# EAGLE design bbSMDuino_v1 (EAGLE 6.3)
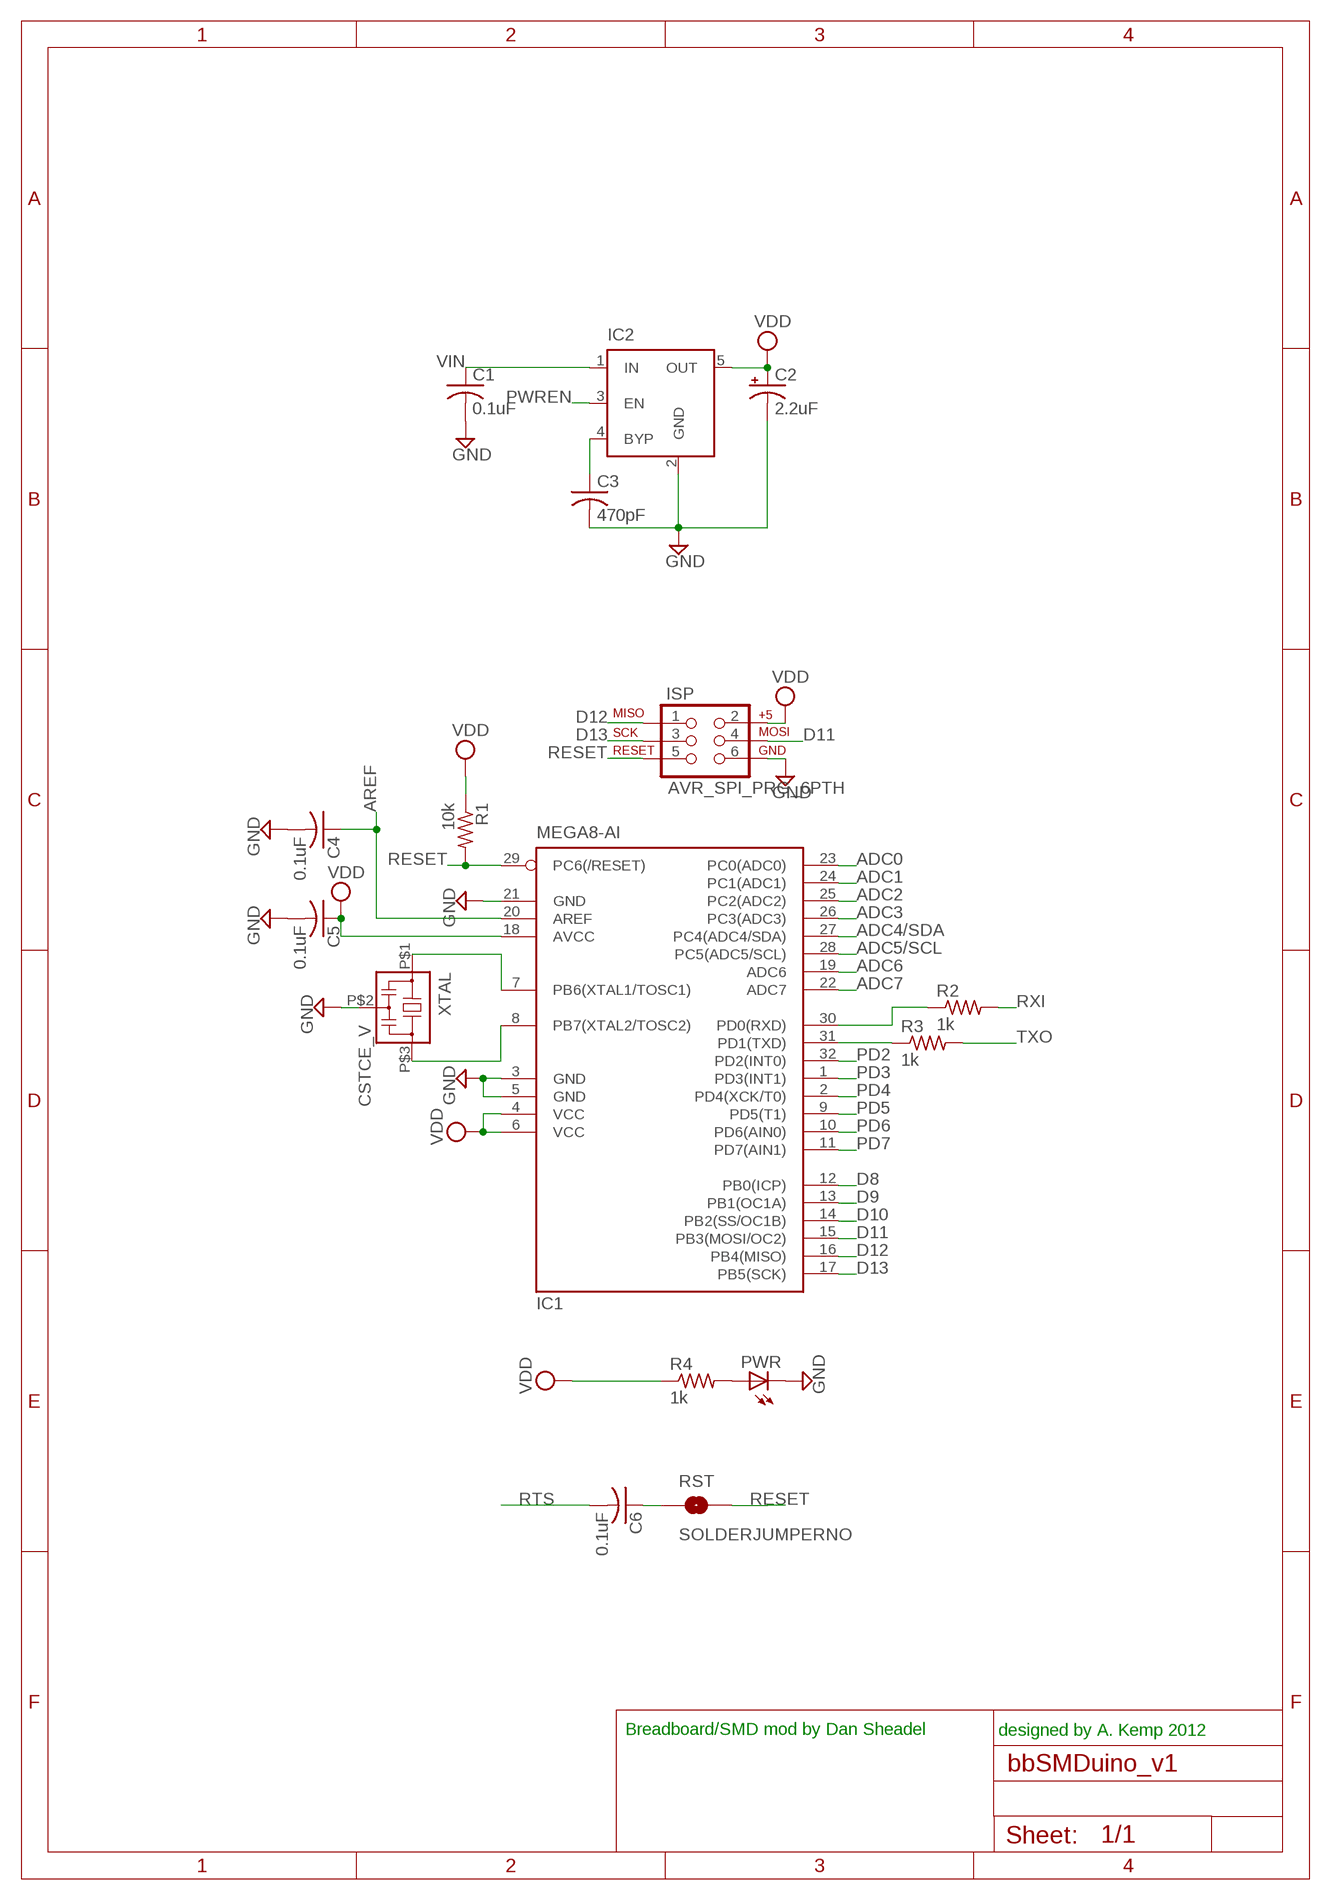
[diagram p0: schematic, sheet 1]

## Parts
C1  0.1uF  C-USC0603  [C0603]
C2  2.2uF  CPOL-USCT3216  [CT3216]
C3  470pF  C-USC0603  [C0603]
C4  0.1uF  C-USC0603  [C0603]
C5  0.1uF  C-USC0603  [C0603]
C6  0.1uF  C-USC0603  [C0603]
IC1  MEGA8-AI  [TQFP32-08]
IC2  MIC5219XX  [SOT23-5]
ISP  AVR_SPI_PRG_6PTH  [2X3]
PWR  LEDCHIP-LED0603  [CHIP-LED0603]
R1  10k  R-US_R0603  [R0603]
R2  1k  R-US_R0603  [R0603]
R3  1k  R-US_R0603  [R0603]
R4  1k  R-US_R0603  [R0603]
RST  SOLDERJUMPERNO  [SJ_2S-NO]
XTAL  CSTCE_V  [CSTCE_V]

## Nets
ADC0: IC1.23(PC0(ADC0))
ADC1: IC1.24(PC1(ADC1))
ADC2: IC1.25(PC2(ADC2))
ADC3: IC1.26(PC3(ADC3))
ADC4/SDA: IC1.27(PC4(ADC4/SDA))
ADC5/SCL: IC1.28(PC5(ADC5/SCL))
ADC6: IC1.19(ADC6)
ADC7: IC1.22(ADC7)
AREF: C4.1 IC1.20(AREF)
D8: IC1.12(PB0(ICP))
D9: IC1.13(PB1(OC1A))
D10: IC1.14(PB2(SS/OC1B))
D11: IC1.15(PB3(MOSI/OC2)) ISP.4
D12: IC1.16(PB4(MISO)) ISP.1
D13: IC1.17(PB5(SCK)) ISP.3
GND: C1.2 C2.- C3.2 C4.2 C5.2 IC1.3(GND) IC1.5(GND) IC1.21(GND) IC2.2(GND) ISP.6 PWR.C XTAL.P$2
N$1: C6.1 RST.1
N$3: PWR.A R4.2
N$4: C3.1 IC2.4(BYP)
N$8: IC1.30(PD0(RXD)) R2.1
N$9: IC1.31(PD1(TXD)) R3.1
PD2: IC1.32(PD2(INT0))
PD3: IC1.1(PD3(INT1))
PD4: IC1.2(PD4(XCK/T0))
PD5: IC1.9(PD5(T1))
PD6: IC1.10(PD6(AIN0))
PD7: IC1.11(PD7(AIN1))
PWREN: IC2.3(EN)
RESET: IC1.29(PC6(/RESET)) ISP.5 R1.2 RST.2
RTS: C6.2
RXI: R2.2
TXO: R3.2
VDD: C2.+ C5.1 IC1.4(VCC) IC1.6(VCC) IC1.18(AVCC) IC2.5(OUT) ISP.2 R1.1 R4.1
VIN: C1.1 IC2.1(IN)
XTAL$1: IC1.7(PB6(XTAL1/TOSC1)) XTAL.P$1
XTAL$2: IC1.8(PB7(XTAL2/TOSC2)) XTAL.P$3

## Notes on the sheet
- designed by A. Kemp 2012
- Breadboard/SMD mod by Dan Sheadel

## Library data of the parts
C1 C3-C6 = rcl:C-US: CAPACITOR, American symbol
C2 = rcl:CPOL-US: POLARIZED CAPACITOR, American symbol
IC1 = atmel:MEGA8: MICROCONTROLLER 8 Kbytes FLASH, 1 kbytes SRAM, 512 bytes EEPROM, USART, 6-channel 10 bit ADC, 2-channel 8 bit ADC Pin compatible with Atmega48, ATMega88, ATMega168 Source: avr.lbr
IC2 = v-reg-micrel:MIC5219XX: VOLTAGE REGULATOR
ISP = SparkFun-Connectors:AVR_SPI_PRG_6: AVR ISP 6 Pin This is the reduced ISP connector for AVR programming. Common on Arduino. This footprint will take up less PCB space and can be used with a 10-pin to 6-pin adapter such as SKU: BOB-08508
PWR = led:LED: LED OSRAM: - CHIPLED LG R971, LG N971, LY N971, LG Q971, LY Q971, LO R971, LY R971 LH N974, LH R974 LS Q976, LO Q976, LY Q976 LO Q996 - Hyper CHIPLED LW Q18S LB Q993, LB Q99A, LB R99A - SideLED LS A670, LO A670, LY A670, LG A670, LP A670 LB A673, LV A673, LT A673, LW A673 LH A674 LY A675 LS A676, LA A676, LO A676, LY A676, LW A676 LS A679, LY A679, LG A679 - Hyper Micro SIDELED® LS Y876, LA Y876, LO Y876, LY Y876 LT Y87S - SmartLED LW L88C, LW L88S LB L89C, LB L89S, LG L890 LS L89K, LO L89K, LY L89K LS L896, LA L896, LO L896, LY L896 - TOPLED LS T670, LO T670, LY T670, LG T670, LP T670 LSG T670, LSP T670, LSY T670, LOP T670, LYG T670 LG T671, LOG T671, LSG T671 LB T673, LV T673, LT T673, LW T673 LH T674 LS T676, LA T676, LO T676, LY T676, LB T676, LH T676, LSB T676, LW T676 LB T67C, LV T67C, LT T67C, LS T67K, LO T67K, LY T67K, LW E67C LS E67B, LA E67B, LO E67B, LY E67B, LB E67C, LV E67C, LT E67C LW T67C LS T679, LY T679, LG T679 LS T770, LO T770, LY T770, LG T770, LP T770 LB T773, LV T773, LT T773, LW T773 LH T774 LS E675, LA E675, LY E675, LS T675 LS T776, LA T776, LO T776, LY T776, LB T776 LHGB T686 LT T68C, LB T68C - Hyper Mini TOPLED® LB M676 - Mini TOPLED Santana® LG M470 LS M47K, LO M47K, LY M47K Source: http://www.osram.convergy.de LUXEON: - LUMILED® LXK2-PW12-R00, LXK2-PW12-S00, LXK2-PW14-U00, LXK2-PW14-V00 LXK2-PM12-R00, LXK2-PM12-S00, LXK2-PM14-U00 LXK2-PE12-Q00, LXK2-PE12-R00, LXK2-PE12-S00, LXK2-PE14-T00, LXK2-PE14-U00 LXK2-PB12-K00, LXK2-PB12-L00, LXK2-PB12-M00, LXK2-PB14-N00, LXK2-PB14-P00, LXK2-PB14-Q00 LXK2-PR12-L00, LXK2-PR12-M00, LXK2-PR14-Q00, LXK2-PR14-R00 LXK2-PD12-Q00, LXK2-PD12-R00, LXK2-PD12-S00 LXK2-PH12-R00, LXK2-PH12-S00 LXK2-PL12-P00, LXK2-PL12-Q00, LXK2-PL12-R00 Source: www.luxeon.com KINGBRIGHT: KA-3528ASYC Source: www.kingbright.com
R1-R4 = resistor:R-US_: RESISTOR, American symbol
RST = SparkFun-Passives:SOLDERJUMPER: Solder Jumper Standard SMD solder jumper. Used to automate production. Two varients : Normally Open and Normally Closed are the same, but have different paste layers. NC will have a large amount of paste and should jumper during reflow.
XTAL = murata-filter:CSTCE_V

## Board
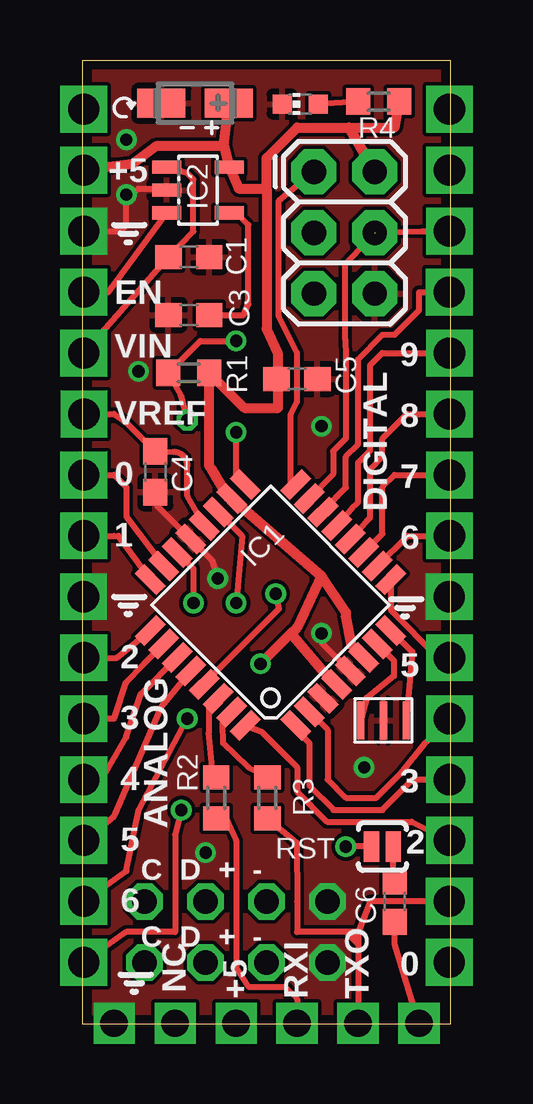
[diagram p1: board, top side]
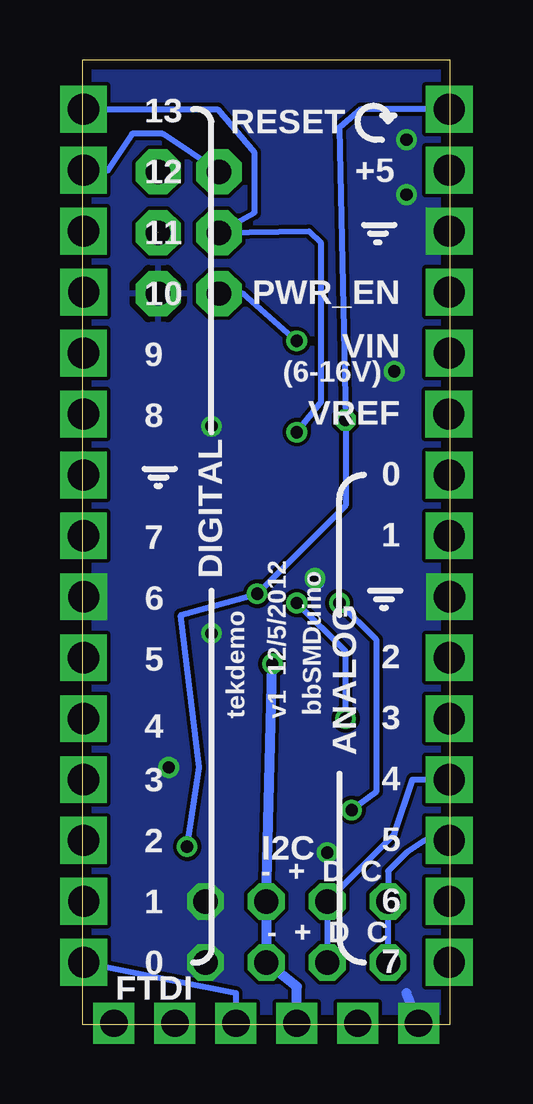
[diagram p2: board, bottom side, seen from below]

Size 15.32 x 40.2 mm. Coordinates in mm from the lower left corner, seen from the top.
Outline: 15.32,0 0,0 0,40.2 15.32,40.2 15.32,0
Copper layers (1*16): Top 0.0356mm / dielectric 1.5011mm / Bottom 0.0356mm
Design rules "LaenPCBOrder": minimum track width 6mil, minimum drill 13mil, track to track 6mil, track to pad 6mil, pad to pad 6mil, via to via 6mil, smd to smd 6mil, copper to edge 15mil, drill to drill 6mil, minimum pad ring 7mil, minimum via ring 7mil, stop-mask expansion 4mil, vias tented up to drill 0mil, thermal gap 10mil

### Footprints (pad centres in the part's own frame; a part is rotated, then mirrored left to right if it is on the bottom)
C0603 = smd 1.1 x 1: 1 -0.85,0; 2 0.85,0
CT3216 = smd 2 x 1.2: + -1.4,0; - 1.4,0
TQFP32-08 = smd 1.27 x 0.559: 1 -4.293,2.8; 2 -4.293,2; 3 -4.293,1.2; 4 -4.293,0.4; 5 -4.293,-0.4; 6 -4.293,-1.2; 7 -4.293,-2; 8 -4.293,-2.8; 17 4.293,-2.8; 18 4.293,-2; 19 4.293,-1.2; 20 4.293,-0.4; 21 4.293,0.4; 22 4.293,1.2; 23 4.293,2; 24 4.293,2.8 | smd 0.559 x 1.27: 9 -2.8,-4.293; 10 -2,-4.293; 11 -1.2,-4.293; 12 -0.4,-4.293; 13 0.4,-4.293; 14 1.2,-4.293; 15 2,-4.293; 16 2.8,-4.293; 25 2.8,4.293; 26 2,4.293; 27 1.2,4.293; 28 0.4,4.293; 29 -0.4,4.293; 30 -1.2,4.293; 31 -2,4.293; 32 -2.8,4.293
SOT23-5 = smd 0.55 x 1.2: 1 -0.95,-1.3; 2 0,-1.3; 3 0.95,-1.3; 4 0.95,1.3; 5 -0.95,1.3
2X3 = drill 1.016 pad 1.88 octagon: 1 0,0; 2 0,2.54; 3 2.54,0; 4 2.54,2.54; 5 5.08,0; 6 5.08,2.54
CHIP-LED0603 = smd 0.8 x 0.8: A 0,-0.75; C 0,0.75
R0603 = smd 1 x 1.1: 1 -0.85,0; 2 0.85,0
SJ_2S-NO = smd 0.635 x 1.27: 1 -0.45,0; 2 0.45,0
CSTCE_V = smd 0.3 x 1.6: P$1 -0.95,0; P$2 0,0; P$3 0.95,0

### Placement (x,y rotation side)
C1  4.42,31.98 0 top
C2  4.67,38.39 180 top
C3  4.42,29.57 180 top
C4  3.02,23.03 270 top
C5  8.93,26.9 0 top
C6  12.99,5.12 270 top
IC1  7.82,17.47 135 top
IC2  4.8,34.77 270 top
ISP  9.63,35.53 270 top
PWR  9.06,38.36 90 top
R1  4.42,27.15 180 top
R2  5.56,9.44 270 top
R3  7.69,9.44 270 top
R4  12.33,38.46 180 top
RST  12.48,7.4 180 top
XTAL  12.53,12.66 0 top

### Tracks (layer width: path | path; a pad name or v marks a point on that pad's centre or on a via)
ADC0  (via drill 1.3)
  Top 0.254: v0.04,22.9 1.31,22.9 1.82,22.39 1.82,21.16 IC1.23
ADC1  (via drill 1.3)
  Top 0.254: v0.04,20.36 1.31,20.36 1.49,20.36 IC1.24
ADC2  (via drill 1.3)
  Top 0.254: v0.04,15.28 1.41,15.28 IC1.25
ADC3  (via drill 1.3)
  Top 0.254: v0.04,12.74 1.31,12.74 1.82,14.26 2.54,15.02 IC1.26
ADC4/SDA  (via drill 1.02, 1.3)
  Top 0.254: v0.04,10.2 0.8,10.2 1.82,11.98 2.41,13.75 IC1.27
  Bottom 0.254: v0.04,10.2 1.56,10.2 2.32,7.91 v5.12,5.12 v5.12,2.58
ADC5/SCL  (via drill 1.02, 1.3)
  Top 0.254: v0.04,7.66 1.31,8.67 3.28,13.25 IC1.28
  Bottom 0.254: v0.04,7.66 1.05,7.66 1.82,7.15 2.58,6.39 v2.58,5.12 v2.58,2.58
ADC6  (via drill 0.51, 1.3)
  Top 0.254: IC1.19 6.64,20.35 v6.39,17.56 | v0.04,5.12 1.82,6.39 2.32,8.93 v4.36,12.74
  Bottom 0.254: v4.36,12.74 4.36,15.53 v6.39,17.56
ADC7  (via drill 0.51, 1.3)
  Top 0.254: IC1.22 4.61,18.99 v4.61,17.56 | v4.1,8.93 3.85,7.91 3.85,3.85 1.82,3.85 v0.04,2.58
  Bottom 0.254: v4.61,17.56 3.09,16.04 3.09,9.69 v4.1,8.93
AREF  (via drill 1.3)
  Top 0.254: v0.05,25.44 1.31,25.44 1.82,25.08 C4.1 3.78,23.86 arc-90 4.36,23.28 4.36,22.01 IC1.20
D8  (via drill 1.3)
  Top 0.254: IC1.12 11.82,20.97 11.98,21.12 11.98,23.15 12.48,23.66 12.48,24.42 13.5,25.44 v15.28,25.44
D9  (via drill 1.3)
  Top 0.254: IC1.13 11.21,21.5 11.47,21.76 11.47,23.41 11.98,23.91 11.98,27.47 12.48,27.98 v15.28,27.98
D10  (via drill 1.3)
  Top 0.254: IC1.14 10.6,22.01 10.96,22.37 10.96,23.66 11.47,24.17 11.47,27.72 12.48,28.74 12.99,28.74 14.01,29.76 14.01,30.52 v15.27,30.52
D11  (via drill 1.3)  (1 unrouted)
  Top 0.254: IC1.15 10.43,22.93 10.43,23.89 10.96,24.42 10.96,27.83 10.94,28.56 10.94,31.69 ISP.4 | ISP.4 14.14,33.06 v15.28,33.06
D12  (via drill 1.3)
  Top 0.254: ISP.1 8.17,34.33 8.17,29.5 8.93,27.98 8.93,25.95 8.67,25.44 8.67,22.54 8.72,22.49 IC1.16
  Bottom 0.254: ISP.1 11.98,37.12 13.25,37.12 14.26,35.6 v15.28,35.6
D13  (via drill 0.51, 1.3)
  Top 0.254: IC1.17 6.39,22.87 v6.39,24.68
  Bottom 0.254: v15.28,38.14 9.69,38.14 8.17,36.36 8.17,33.82 ISP.3 5.88,33.06 5.37,32.55 5.37,25.95 v6.39,24.68
GND  (via drill 0.51, 1.02, 1.14, 1.3)
  Top 0.254: v0.04,33.06 1.56,33.06 1.82,33.31 1.82,34.33 2.32,34.84 3.18,34.84 IC2.2 | C4.2 3.09,21.63 5.37,19.34 v5.63,18.58 | IC1.5 9.94,15.92 v9.94,16.29
  Bottom 0.254: v5.63,18.58 5.37,18.33
  Bottom 0.406: v1.31,0.04 1.82,1.31
  other vias: 15.27,17.82 10.2,5.12 1.82,34.58 2.32,27.22 1.82,36.87 11.72,10.71 0.03,17.82 9.94,24.93 10.2,2.58 5.12,7.15
  pour Bottom: 0.04,0.04 15.28,0.04 15.28,40.17 0.04,40.17
  pour Top (rank 2): 0.04,0.04 15.28,0.04 15.28,40.17 0.04,40.17
N$1
  Top 0.254: C6.1 12.93,5.91 | 12.9,5.88 12.93,5.91 | 12.93,5.91 RST.1
N$2  (via drill 1.14)
  other vias: 3.85,0.04
N$3
  Top 0.254: R4.2 PWR.A
N$4
  Top 0.254: C3.1 6.71,29.57 6.9,30.01 6.9,33.31 6.39,33.82 IC2.4
N$8
  Top 0.254: R2.1 5.39,10.67 5.26,12.15 5.26,13.17 5.89,13.76 IC1.30
N$9
  Top 0.254: IC1.31 6.46,13.06 5.82,12.52 5.84,11.72 6.9,10.71 7.15,10.59 R3.1
PD2  (via drill 1.3)
  Top 0.254: IC1.32 7.43,12.21 8.93,10.71 8.93,9.69 10.17,8.45 13.7,8.45 v15.28,7.66
PD3  (via drill 1.3)
  Top 0.254: IC1.1 8.95,12.46 8.95,12.21 9.44,11.72 9.44,9.94 10.45,8.93 12.48,8.93 13.75,10.2 v15.28,10.2
PD4  (via drill 1.3)
  Top 0.254: v15.28,12.74 14.26,11.72 13.25,10.45 12.23,9.44 10.96,9.44 10.2,10.2 10.2,12.27 IC1.2
PD5  (via drill 1.3)
  Top 0.254: IC1.9 12.84,17.26 14.82,15.28 v15.28,15.28
PD6  (via drill 1.3)
  Top 0.254: IC1.10 13.53,20.36 v15.28,20.36
PD7  (via drill 1.3)
  Top 0.254: IC1.11 12.48,20.44 12.48,22.39 12.99,22.9 v15.28,22.9
PWREN  (via drill 1.3)
  Top 0.254: IC2.3 1.05,30.52 v0.04,30.52
RESET  (via drill 0.51, 1.3)
  Top 0.254: v4.36,25.18 4.08,26.22 R1.2 4.9,28.49 v6.39,28.49 | IC1.29 5.32,14.47 8.17,17.31 v8.04,17.95 | RST.2 v10.96,7.4
  Bottom 0.254: v0.04,38.14 3.72,38.14 4.61,37.38 v4.36,25.18 4.36,21.63 v8.04,17.95 11.21,17.06 10.45,10.71 v10.96,7.4 | v6.39,28.49 8.61,30.45 ISP.5
RTS  (via drill 1.14)
  Top 0.254: v14.01,0.04 12.99,3.34 C6.2
RXI  (via drill 1.14, 1.3)
  Top 0.254: R2.2 5.97,8.59 6.39,7.66 6.39,2.32 6.9,1.56 8.42,1.56 8.93,1.05 v8.93,0.04
  Bottom 0.254: v15.27,2.58 11.46,1.82 8.93,1.31 v8.93,0.04
TXO  (via drill 1.14, 1.3)
  Top 0.254: R3.2 8.91,7.57 8.93,5.12 8.93,3.85 10.96,3.85 | 11.47,3.85 11.47,3.59 | 11.47,3.59 11.47,3.34 | 11.47,3.34 v11.47,0.04 | v15.27,5.12 11.98,5.12 11.47,3.85 | 11.47,3.85 10.96,3.85 | 11.47,3.34 10.96,3.85 | 10.96,3.85 11.47,3.59
VDD  (via drill 0.51, 1.02, 1.14, 1.3)
  Top 0.254: 7.66,28.99 8.17,27.91 | IC1.18 6.09,21.92 | IC1.6 11.21,15.79 | C5.1 8.14,26.84
  Top 0.406: 5.88,36.61 3.09,36.61 2.07,35.85 v0.04,35.6 | 5.88,36.61 IC2.5 6.49,34.83 7.66,34.84 | 7.66,34.84 7.66,28.99 8.14,27.95 8.14,26.84 8.14,25.69 6.73,25.69 R1.1 5.27,23.25 5.37,23.15 6.09,21.92 | 11.21,15.79 10.96,17.06 10.96,17.17 9.94,18.69 | 8.67,16.29 8.93,16.55 9.94,18.69 | 8.67,16.29 9.94,14.79 IC1.4 | IC1.18 9.94,18.69 | 11.09,37.38 ISP.2 | v7.4,15.02 8.67,16.29 | 7.66,34.84 7.66,36.11 8.93,37.38 11.09,37.38 | 5.88,36.61 C2.+ | 11.09,37.38 12.99,37.38 R4.1
  Bottom 0.406: v6.39,0.04 6.39,1.56 v7.66,2.58 v7.66,5.12 v7.4,15.02
VIN  (via drill 1.3)
  Top 0.254: v0.04,27.98 C1.1 4.61,33.06 4.61,35.22 4.36,35.47 IC2.1
XTAL$1
  Top 0.254: IC1.7 12.97,15.16 12.97,14.52 11.83,13.61 XTAL.P$1
XTAL$2
  Top 0.254: IC1.8 13.73,15.53 XTAL.P$3

### Text on the board
tPlace: +5 | EN | VIN | 9 | VREF | 8 | 0 | 7 | DIGITAL | 1 | 6 | 2 | 5 | 3 | 4 | 3 | 5 | ANALOG | 2 | C D + - | 6 | C D + - | 0 | NC | +5 | RXI | TXO
bPlace: RESET | 13 | +5 | 12 | 11 | PWR_EN | 10 | VIN | 9 | (6-16V) | VREF | 8 | 0 | 1 | 7 | DIGITAL | 6 | 2 | 5 | 3 | bbSMDuino | v1 12/5/2012 | tekdemo | 4 | ANALOG | 4 | 3 | 5 | I2C | 2 | - + D C | 6 | 1 | - + D C | 7 | 0 | FTDI
Document: RESET | D13 | VDD | D12 | GND | D11 | PWEREN | D10 | VIn | D9 | ARef | D8 | A0 | D7 | A1 | D6 | GND | GND | A2 | D5 | A3 | D4 | A4 | D3 | A5 | D2 | A6 | D1 | A7 | D0
202bmp: /Users/Adam/Documents/Graphics/stamp.bmp